# Altium schematic sheet MB1280_Fanout.SchDoc: Fanout Board
size A4; DocumentNumber: MB1280; Revision: A.2; SheetNumber: 1; SheetTotal: 1; Project: STM32H7-DK-DB
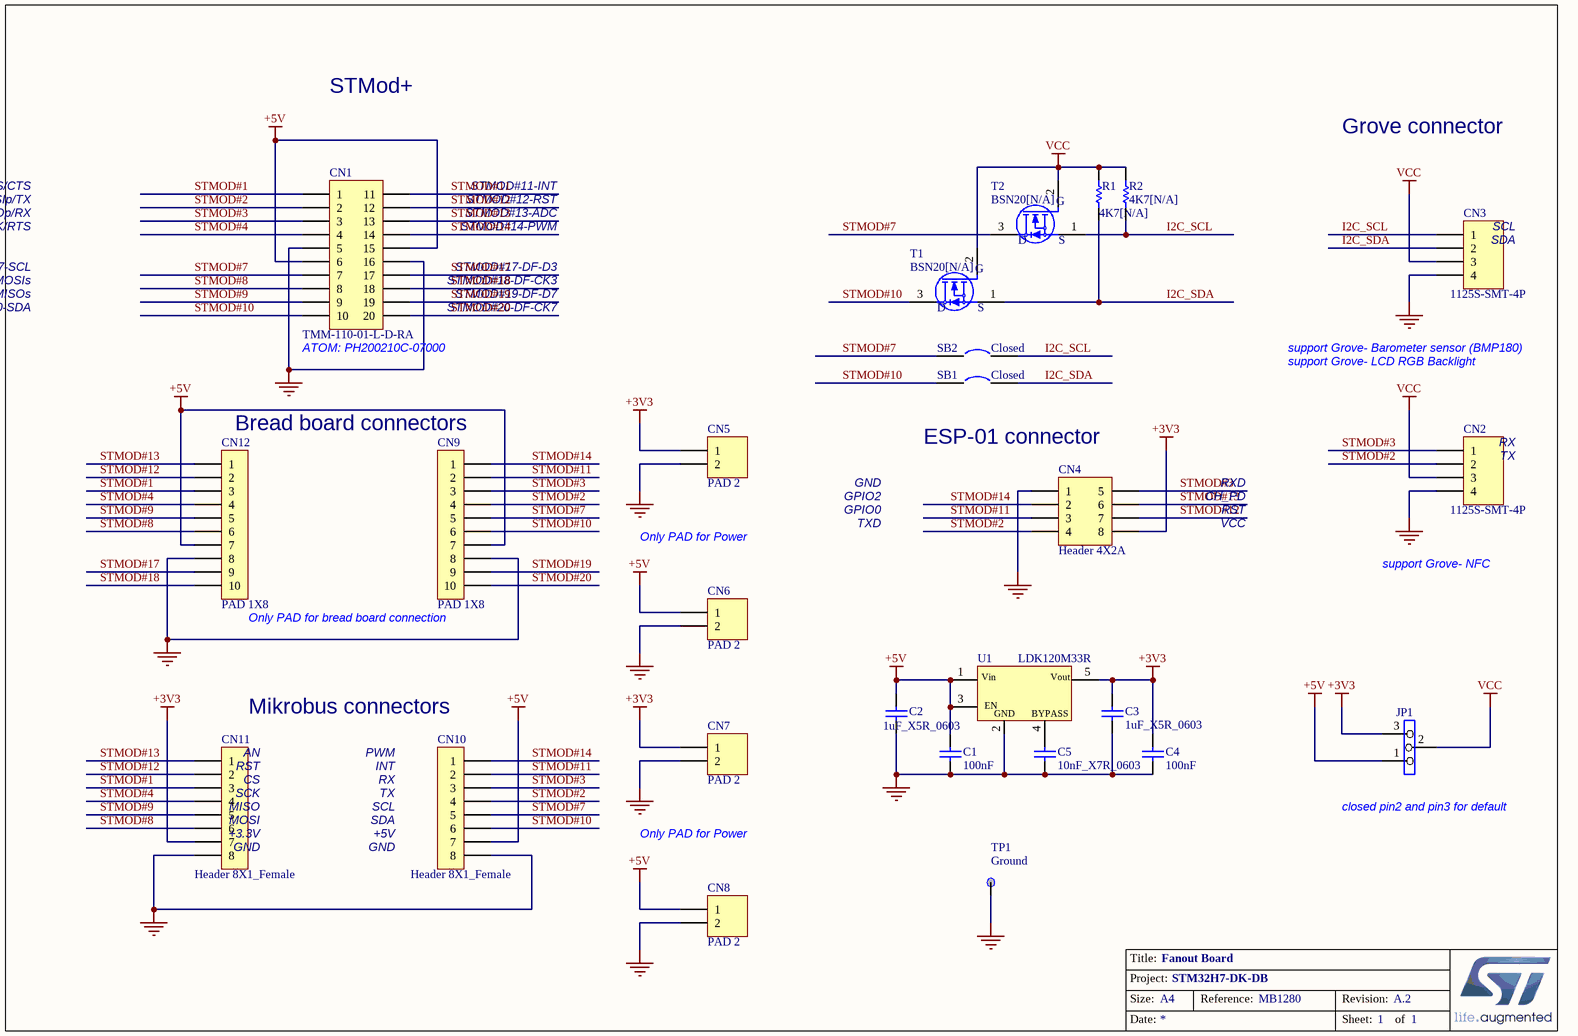
[diagram p0: MB1280_Fanout.SchDoc]

## Parts
C1  100nF  [0603C]
C2  1uF_X5R_0603  [0603C]
C3  1uF_X5R_0603  [0603C]
C4  100nF  [0603C]
C5  10nF_X7R_0603  [0603C]
CN1  TMM-110-01-L-D-RA  [2*10_MALE_2MM_H]
CN2  1125S-SMT-4P  [1X4_MALE_C]
CN3  1125S-SMT-4P  [1X4_MALE_C]
CN4  Header 4X2A  [HDR2X4_CEN1]
CN5  PAD 2  [HDR_2X1_2R54]
CN6  PAD 2  [HDR_2X1_2R54]
CN7  PAD 2  [HDR_2X1_2R54]
CN8  PAD 2  [HDR_2X1_2R54]
CN9  PAD 1X8  [1*10P_FEMALE]
CN10  Header 8X1_Female  [1*8P_FEMALE]
CN11  Header 8X1_Female  [1*8P_FEMALE]
CN12  PAD 1X8  [1*10P_FEMALE]
JP1  (no value)  [SIP3]
R1  4K7[N/A]  [0603R]
R2  4K7[N/A]  [0603R]
SB1  Closed  [SB_0603]
SB2  Closed  [SB_0603]
T1  BSN20[N/A]  [SOT23-213]
T2  BSN20[N/A]  [SOT23-213]
TP1  Ground  [TP_C4MM_PAD]
U1  LDK120M33R  [SOT-23-5L]

## Nets
+3V3: C3.1 C4.2 CN4.8 CN5.1 CN7.1 CN11.7 JP1.3 U1.5(Vout)
+5V: C1.2 C2.2 CN1.6 CN1.15 CN6.1 CN8.1 CN9.7 CN10.7 CN12.7 JP1.1 U1.1(Vin) U1.3(CE)
GND: C1.1 C2.1 C3.2 C4.1 C5.1 CN1.5 CN1.16 CN2.4 CN3.4 CN4.1 CN5.2 CN6.2 CN7.2 CN8.2 CN9.8 CN10.8 CN11.8 CN12.8 TP1.1 U1.2(GND)
VCC: CN2.3 CN3.3 JP1.2 R1.2 R2.2 T1.2(G) T2.2(G)
I2C_SCL: CN3.1 R2.1 SB2.2 T2.1(S)
I2C_SDA: CN3.2 R1.1 SB1.2 T1.1(S)
STMOD#1: CN1.1 CN11.3 CN12.3
STMOD#2: CN1.2 CN2.2 CN4.4 CN9.4 CN10.4
STMOD#3: CN1.3 CN2.1 CN4.5 CN9.3 CN10.3
STMOD#4: CN1.4 CN11.4 CN12.4
STMOD#7: CN1.7 CN9.5 CN10.5 SB2.1 T2.3(D)
STMOD#8: CN1.8 CN11.6 CN12.6
STMOD#9: CN1.9 CN11.5 CN12.5
STMOD#10: CN1.10 CN9.6 CN10.6 SB1.1 T1.3(D)
STMOD#11: CN1.11 CN4.3 CN9.2 CN10.2
STMOD#12: CN1.12 CN4.7 CN11.2 CN12.2
STMOD#13: CN1.13 CN4.6 CN11.1 CN12.1
STMOD#14: CN1.14 CN4.2 CN9.1 CN10.1
STMOD#17: CN1.17 CN12.9
STMOD#18: CN1.18 CN12.10
STMOD#19: CN1.19 CN9.9
STMOD#20: CN1.20 CN9.10
NetC5_2: C5.2 U1.4(BYPASS)

## Notes on the sheet
- STMod+
- Grove connector
- STMOD#1-NSS/CTS
- STMOD#2-MOSIp/TX
- STMOD#3-MISOp/RX
- STMOD#4-SCK/RTS
- STMOD#11-INT
- STMOD#12-RST
- STMOD#13-ADC
- STMOD#14-PWM
- SCL
- SDA
- STMOD#7-SCL
- STMOD#8-MOSIs
- STMOD#9-MISOs
- STMOD#10-SDA
- STMOD#17-DF-D3
- STMOD#18-DF-CK3
- STMOD#19-DF-D7
- STMOD#20-DF-CK7
- (near CN1) ATOM: PH200210C-07000
- support Grove- Barometer sensor (BMP180)
- support Grove- LCD RGB Backlight
- Bread board connectors
- ESP-01 connector
- RX
- GND
- GPIO2
- GPIO0
- RXD
- CH_PD
- RST
- TX
- Only PAD for Power
- TXD
- VCC
- support Grove- NFC
- Only PAD for bread board connection
- Mikrobus connectors
- (near CN11) AN
- (near CN11) RST
- (near CN11) CS
- (near CN10) PWM
- (near CN10) INT
- (near CN11) SCK
- (near CN11) MISO
- (near CN11) MOSI
- (near CN11) +3.3V
- (near CN11) GND
- (near CN10) SCL
- (near CN10) SDA
- (near CN10) +5V
- (near CN10) GND
- (near JP1) closed pin2 and pin3 for default
- Title:
- Project:
- Size:
- Date:
- A4
- Reference:
- Sheet:
- Revision:
- of
- (in symbol LDK120M33R) EN

## Library data of the parts
C1 C4 = Capacitor_ST: Capacitor 0402 / 0603 / 0805; Revision: July-2002: Re-released for DXP Platform.; Value: 100nF
C2 C3 = CAP SMD 0603  X5R 1礔 25V 10%: 0603  X5R 1礔; Rated voltage: 25V; Tolerance: 10%; Manufacturer: *; Manufacturer P/N: *; Order code Farnell: 1288202RL; Value: 1礔; Power: *; Technology: X5R; Temperature  Factor: *; Temperature Max: +125癈; Temperature Min: -55癈; STS Code: *
C5 = CAP SMD 0603  X7R 10000PF 50V 10%: 0603  X7R 10NF; Order code RS: 2040779; Rated voltage: 50V; Tolerance: 10%; Order code Farnell: 7569548RL; Value: 10NF; Power: *; Technology: X7R; Temperature Factor: *; Temperature Min: -55癈; Temperature Max: +125癈; STS Code: *
CN1 = Header 10X2A: Header, 10-Pin, Dual row; LatestRevisionDate: 17-Jul-2002; LatestRevisionNote: Re-released for DXP Platform.; Publisher: Altium Limited
CN2 CN3 = Header 4: LatestRevisionDate: 17-Jul-2002; LatestRevisionNote: Re-released for DXP Platform.; Publisher: Altium Limited
CN4 = Header 4X2A: Header, 4-Pin, Dual row; LatestRevisionDate: 17-Jul-2002; LatestRevisionNote: Re-released for DXP Platform.; Publisher: Altium Limited
CN5-CN8 = Header 2: Header, 2-Pin; LatestRevisionDate: 17-Jul-2002; LatestRevisionNote: Re-released for DXP Platform.; Publisher: Altium Limited
CN9 CN12 = Header 10X1_Female: Header, 10-Pin, Single row,female; Ordered by: Subcon; ECCN_US/EU: NA; LatestRevisionDate: 17-Jul-2002; LatestRevisionNote: Re-released for DXP Platform.; Publisher: Altium Limited
CN10 CN11 = Header 8X1_Female: Header, 8-Pin, Single row,female; Ordered by: Subcon; ECCN_US/EU: NA; LatestRevisionDate: 17-Jul-2002; LatestRevisionNote: Re-released for DXP Platform.; Publisher: Altium Limited
JP1 = Jumper3
R1 R2 = res1: Resistor; Value: 1K; Published: 8-Jun-2000; Revision: July-2002: Re-released for DXP Platform.; Publisher: Altium Limited
SB1 SB2 = Circuit Breaker: Ordered by: Subcon; Comments: Solder bridge; ECCN_US/EU: NA; Published: 24-Mar-1999; Revision: July-2002: Re-released for DXP Platform.; Publisher: Altium Limited
T1 T2 = 2N7000
TP1 = TP
U1 = LDK120M33R: 200 mA low quiescent current very low noise LDO; Manuf_1: STM; Provided: ST; Ref St: 9176161; ECCN_US/EU: EAR99/NEC; Manuf_Part_1: LDK120M33R; Distrib: ST; Order: LDK120M33R